# Altium schematic sheet Hub.SchDoc
size B
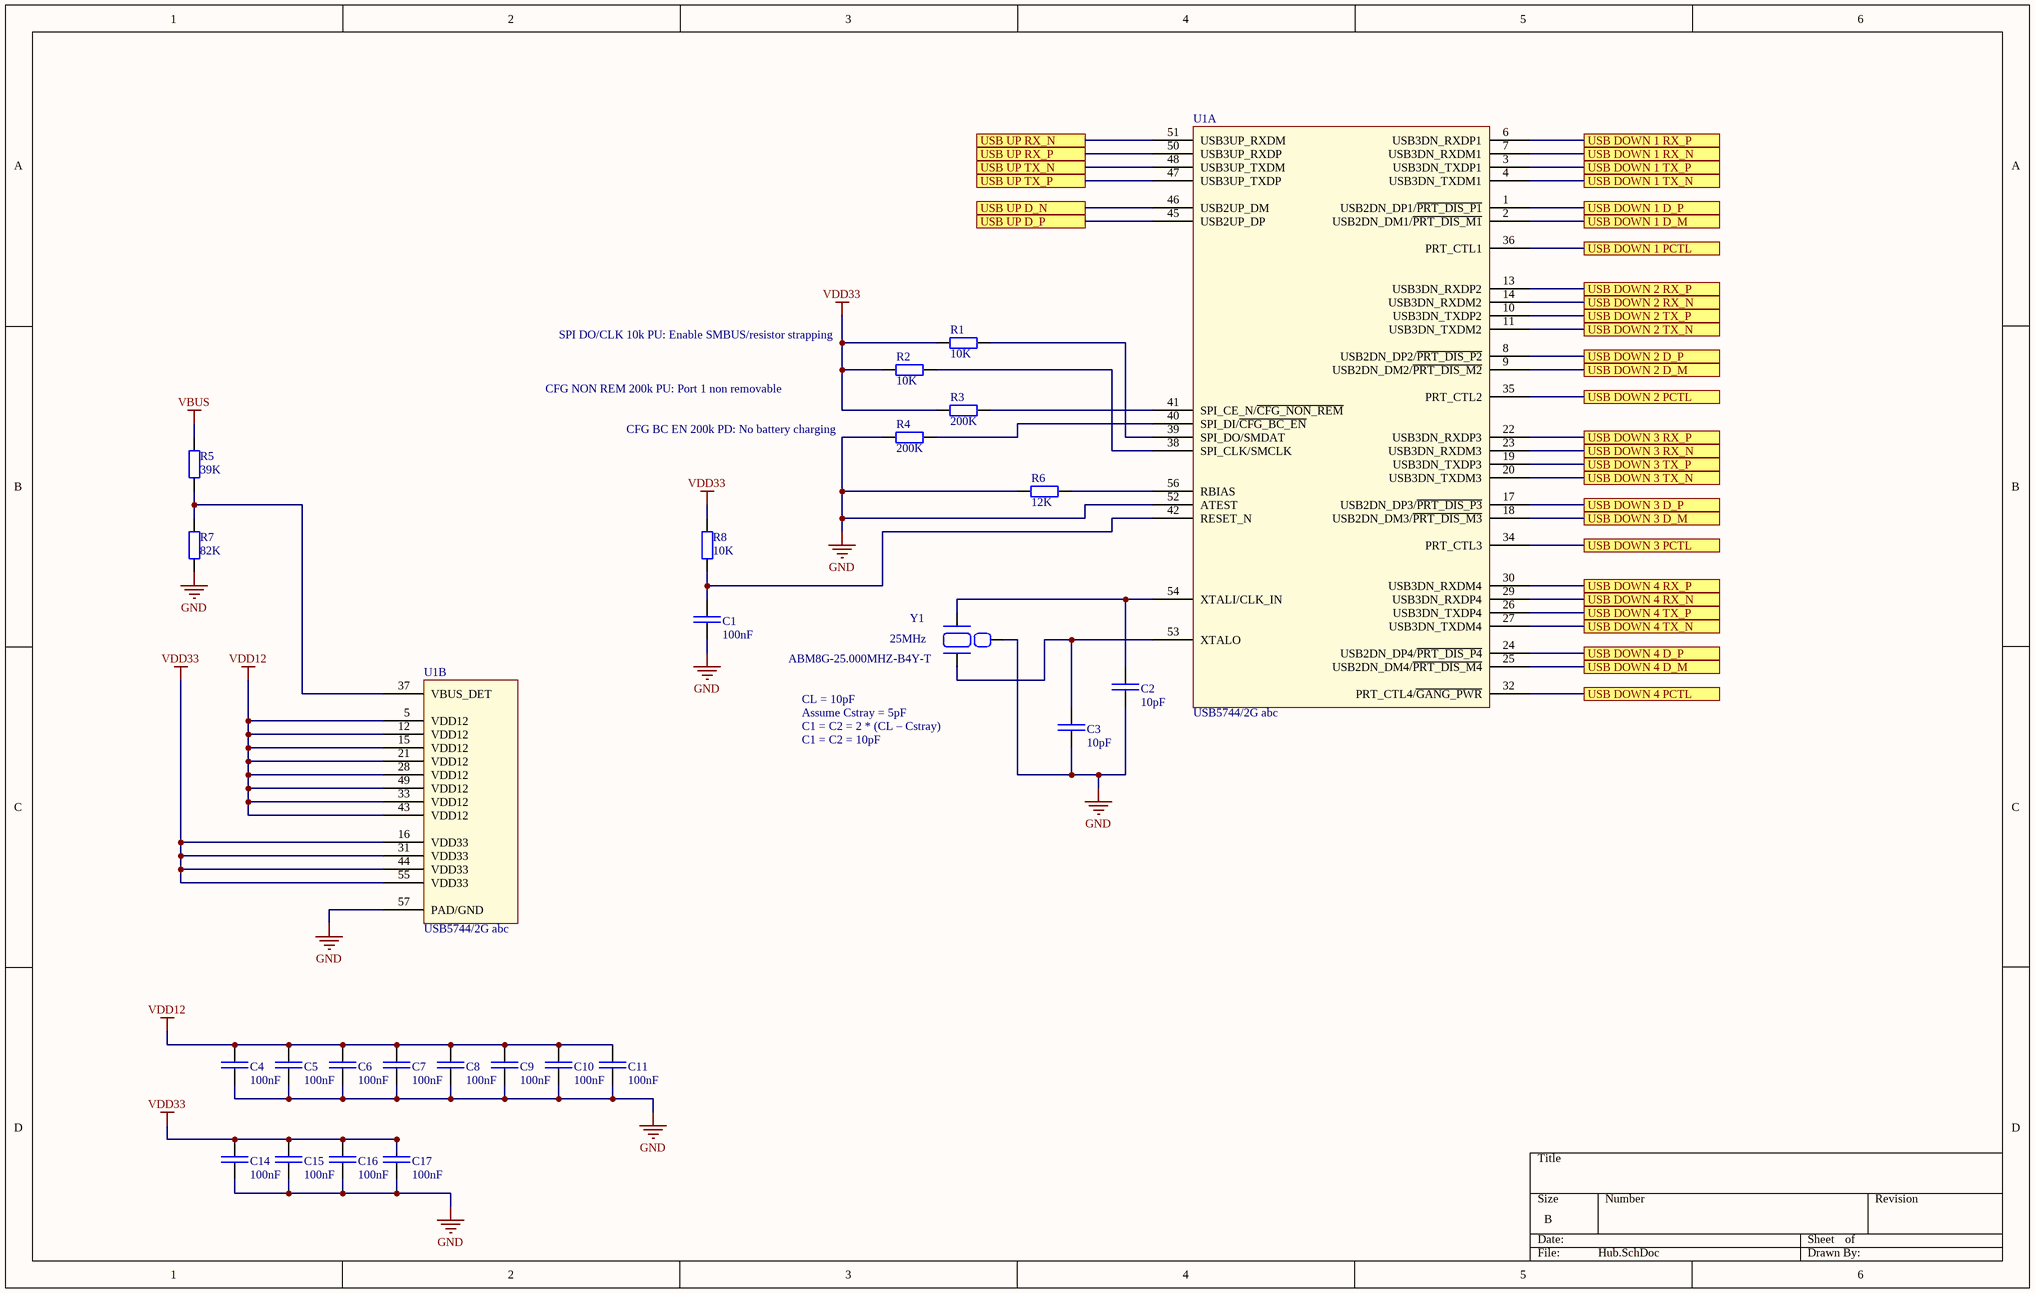
[diagram p0: Hub.SchDoc]

## Parts
C1  100nF  [CAP_SM0603_YAGEOCC2_N]
C2  10pF  [CAP_SM0603_YAGEOCC2_N]
C3  10pF  [CAP_SM0603_YAGEOCC2_N]
C4  100nF  [CAP_SM0603_YAGEOCC2_N]
C5  100nF  [CAP_SM0603_YAGEOCC2_N]
C6  100nF  [CAP_SM0603_YAGEOCC2_N]
C7  100nF  [CAP_SM0603_YAGEOCC2_N]
C8  100nF  [CAP_SM0603_YAGEOCC2_N]
C9  100nF  [CAP_SM0603_YAGEOCC2_N]
C10  100nF  [CAP_SM0603_YAGEOCC2_N]
C11  100nF  [CAP_SM0603_YAGEOCC2_N]
C14  100nF  [CAP_SM0603_YAGEOCC2_N]
C15  100nF  [CAP_SM0603_YAGEOCC2_N]
C16  100nF  [CAP_SM0603_YAGEOCC2_N]
C17  100nF  [CAP_SM0603_YAGEOCC2_N]
R1  10K  [RES_SM0603_YAGEORC_N]
R2  10K  [RES_SM0603_YAGEORC_N]
R3  200K  [RES_SM0603_YAGEORC_N]
R4  200K  [RES_SM0603_YAGEORC_N]
R5  39K  [RES_SM0603_YAGEORC_N]
R6  12K  [RES_SM0603_YAGEORC_N]
R7  82K  [RES_SM0603_YAGEORC_N]
R8  10K  [RES_SM0603_YAGEORC_N]
U1  USB5744/2G abc  [QFN40P700X700X100_HS-57N - USB5744/2G]  (parts A,B of 2)
Y1  ABM8G-25.000MHZ-B4Y-T  [ABM8G-25.000MHZ-B4Y-T]

## Ports
USB DOWN 1 D_M, USB DOWN 1 D_P, USB DOWN 1 PCTL, USB DOWN 1 RX_N, USB DOWN 1 RX_P, USB DOWN 1 TX_N, USB DOWN 1 TX_P, USB DOWN 2 D_M, USB DOWN 2 D_P, USB DOWN 2 PCTL, USB DOWN 2 RX_N, USB DOWN 2 RX_P, USB DOWN 2 TX_N, USB DOWN 2 TX_P, USB DOWN 3 D_M, USB DOWN 3 D_P, USB DOWN 3 PCTL, USB DOWN 3 RX_N, USB DOWN 3 RX_P, USB DOWN 3 TX_N, USB DOWN 3 TX_P, USB DOWN 4 D_M, USB DOWN 4 D_P, USB DOWN 4 PCTL, USB DOWN 4 RX_N, USB DOWN 4 RX_P, USB DOWN 4 TX_N, USB DOWN 4 TX_P, USB UP D_N, USB UP D_P, USB UP RX_N, USB UP RX_P, USB UP TX_N, USB UP TX_P

## Nets
GND: C1.2 C2.1 C3.1 C4.2 C5.2 C6.2 C7.2 C8.2 C9.2 C10.2 C11.2 C14.2 C15.2 C16.2 C17.2 R4.1 R6.1 R7.1 U1.52(ATEST) U1.57(PAD/GND) Y1.GND
VBUS: R5.2
VDD12: C4.1 C5.1 C6.1 C7.1 C8.1 C9.1 C10.1 C11.1 U1.5(VDD12) U1.12(VDD12) U1.15(VDD12) U1.21(VDD12) U1.28(VDD12) U1.33(VDD12) U1.43(VDD12) U1.49(VDD12)
VDD33: C14.1 C15.1 C16.1 C17.1 R1.1 R2.1 R3.1 R8.2 U1.16(VDD33) U1.31(VDD33) U1.44(VDD33) U1.55(VDD33)
USB DOWN 1 D_M: U1.2(USB2DN_DM1/~{PRT_DIS_M1}) ; port USB DOWN 1 D_M
USB DOWN 1 D_P: U1.1(USB2DN_DP1/~{PRT_DIS_P1}) ; port USB DOWN 1 D_P
USB DOWN 1 PCTL: U1.36(PRT_CTL1) ; port USB DOWN 1 PCTL
USB DOWN 1 RX_N: U1.7(USB3DN_RXDM1) ; port USB DOWN 1 RX_N
USB DOWN 1 RX_P: U1.6(USB3DN_RXDP1) ; port USB DOWN 1 RX_P
USB DOWN 1 TX_N: U1.4(USB3DN_TXDM1) ; port USB DOWN 1 TX_N
USB DOWN 1 TX_P: U1.3(USB3DN_TXDP1) ; port USB DOWN 1 TX_P
USB DOWN 2 D_M: U1.9(USB2DN_DM2/~{PRT_DIS_M2}) ; port USB DOWN 2 D_M
USB DOWN 2 D_P: U1.8(USB2DN_DP2/~{PRT_DIS_P2}) ; port USB DOWN 2 D_P
USB DOWN 2 PCTL: U1.35(PRT_CTL2) ; port USB DOWN 2 PCTL
USB DOWN 2 RX_N: U1.14(USB3DN_RXDM2) ; port USB DOWN 2 RX_N
USB DOWN 2 RX_P: U1.13(USB3DN_RXDP2) ; port USB DOWN 2 RX_P
USB DOWN 2 TX_N: U1.11(USB3DN_TXDM2) ; port USB DOWN 2 TX_N
USB DOWN 2 TX_P: U1.10(USB3DN_TXDP2) ; port USB DOWN 2 TX_P
USB DOWN 3 D_M: U1.18(USB2DN_DM3/~{PRT_DIS_M3}) ; port USB DOWN 3 D_M
USB DOWN 3 D_P: U1.17(USB2DN_DP3/~{PRT_DIS_P3}) ; port USB DOWN 3 D_P
USB DOWN 3 PCTL: U1.34(PRT_CTL3) ; port USB DOWN 3 PCTL
USB DOWN 3 RX_N: U1.23(USB3DN_RXDM3) ; port USB DOWN 3 RX_N
USB DOWN 3 RX_P: U1.22(USB3DN_RXDP3) ; port USB DOWN 3 RX_P
USB DOWN 3 TX_N: U1.20(USB3DN_TXDM3) ; port USB DOWN 3 TX_N
USB DOWN 3 TX_P: U1.19(USB3DN_TXDP3) ; port USB DOWN 3 TX_P
USB DOWN 4 D_M: U1.25(USB2DN_DM4/~{PRT_DIS_M4}) ; port USB DOWN 4 D_M
USB DOWN 4 D_P: U1.24(USB2DN_DP4/~{PRT_DIS_P4}) ; port USB DOWN 4 D_P
USB DOWN 4 PCTL: U1.32(PRT_CTL4/~{GANG_PWR}) ; port USB DOWN 4 PCTL
USB DOWN 4 RX_N: U1.29(USB3DN_RXDP4) ; port USB DOWN 4 RX_N
USB DOWN 4 RX_P: U1.30(USB3DN_RXDM4) ; port USB DOWN 4 RX_P
USB DOWN 4 TX_N: U1.27(USB3DN_TXDM4) ; port USB DOWN 4 TX_N
USB DOWN 4 TX_P: U1.26(USB3DN_TXDP4) ; port USB DOWN 4 TX_P
USB UP D_N: U1.46(USB2UP_DM) ; port USB UP D_N
USB UP D_P: U1.45(USB2UP_DP) ; port USB UP D_P
USB UP RX_N: U1.51(USB3UP_RXDM) ; port USB UP RX_N
USB UP RX_P: U1.50(USB3UP_RXDP) ; port USB UP RX_P
USB UP TX_N: U1.48(USB3UP_TXDM) ; port USB UP TX_N
USB UP TX_P: U1.47(USB3UP_TXDP) ; port USB UP TX_P
NetC1_1: C1.1 R8.1 U1.42(RESET_N)
NetC2_2: C2.2 U1.54(XTALI/CLK_IN) Y1.1
NetC3_2: C3.2 U1.53(XTALO) Y1.3
NetR1_2: R1.2 U1.39(SPI_DO/SMDAT)
NetR2_2: R2.2 U1.38(SPI_CLK/SMCLK)
NetR3_2: R3.2 U1.41(SPI_CE_N/~{CFG_NON_REM})
NetR4_2: R4.2 U1.40(SPI_DI/~{CFG_BC_EN})
NetR5_1: R5.1 R7.2 U1.37(VBUS_DET)
NetR6_2: R6.2 U1.56(RBIAS)

## Notes on the sheet
- (near R2) SPI DO/CLK 10k PU: Enable SMBUS/resistor strapping
- CFG NON REM 200k PU: Port 1 non removable
- (near R4) CFG BC EN 200k PD: No battery charging
- CL = 10pF
- C1 = C2 = 2 * (CL – Cstray)
- Assume Cstray = 5pF
- C1 = C2 = 10pF
- (in symbol ABM8G-25.000MHZ-B4Y-T) 25MHz

## Library data of the parts
C1 C4-C11 C14-C17 = CC0603KRX7R9BB104: CAP 100nF SM0603 X7R 50V YAGEO CC2; Tolerance (%): 10; Voltage Rating (Volts): 50; Category: Capacitor; Manufacturer: Yageo; Manufacturer Part Number: CC0603KRX7R9BB104; Package: 0603; Value: 100nF; Supplier Part Number 1: 1362556; Supplier 1: Farnell; ComponentLink1URL: http://www.yageo.com; ComponentLink1Description: Manufacturer Website; Supplier 2: Digi-Key; Supplier Part Number 2: 311-1344-1-ND
C2 C3 = CC0603JRNPO9BN100: CAP 10pF SM0603 NPO 50V YAGEO CC2; Tolerance (%): 5; Voltage Rating (Volts): 50; Category: Capacitor; Manufacturer: Yageo; Manufacturer Part Number: CC0603JRNPO9BN100; Package: 0603; Value: 10pF; Supplier Part Number 1: 721967; Supplier 1: Farnell; ComponentLink1URL: http://www.yageo.com; ComponentLink1Description: Manufacturer Website; Supplier 2: Digi-Key; Supplier Part Number 2: 311-1058-1-ND
R1 R2 R8 = RC0603FR-0710KL: RES 10K SM0603 YAGEO RC_L; Power (Watts): 0.1; Resistance (Ohms): 10000; Tolerance (%): 1; Category: Resistor; Manufacturer: Yageo; Manufacturer Part Number: RC0603FR-0710KL; Package: 0603; Value: 10K; Supplier Part Number 1: 9238603; Supplier 1: Farnell; ComponentLink1URL: http://www.yageo.com; ComponentLink1Description: Manufacturer Website; Supplier 2: Digi-Key; Supplier Part Number 2: 311-10.0KHRCT-ND
R3 R4 = RC0603FR-07200KL: RES 200K SM0603 YAGEO RC_L; Power (Watts): 0.1; Resistance (Ohms): 200000; Tolerance (%): 1; Category: Resistor; Manufacturer: Yageo; Manufacturer Part Number: RC0603FR-07200KL; Package: 0603; Value: 200K; ComponentLink1URL: http://www.yageo.com; ComponentLink1Description: Manufacturer Website; Supplier 2: Digi-Key; Supplier Part Number 2: 311-200KHRCT-ND
R5 = RC0603FR-0739KL: RES 39K SM0603 YAGEO RC_L; Power (Watts): 0.1; Resistance (Ohms): 39000; Tolerance (%): 1; Category: Resistor; Manufacturer: Yageo; Manufacturer Part Number: RC0603FR-0739KL; Package: 0603; Value: 39K; Supplier Part Number 1: 9238670; Supplier 1: Farnell; ComponentLink1URL: http://www.yageo.com; ComponentLink1Description: Manufacturer Website; Supplier 2: Digi-Key; Supplier Part Number 2: 311-39.0KHRCT-ND
R6 = RC0603FR-0712KL: RES 12K SM0603 YAGEO RC_L; Power (Watts): 0.1; Resistance (Ohms): 12000; Tolerance (%): 1; Category: Resistor; Manufacturer: Yageo; Manufacturer Part Number: RC0603FR-0712KL; Package: 0603; Value: 12K; Supplier Part Number 1: 9238611; Supplier 1: Farnell; ComponentLink1URL: http://www.yageo.com; ComponentLink1Description: Manufacturer Website; Supplier 2: Digi-Key; Supplier Part Number 2: 311-12.0KHRCT-ND
R7 = RC0603FR-0782KL: RES 82K SM0603 YAGEO RC_L; Power (Watts): 0.1; Resistance (Ohms): 82000; Tolerance (%): 1; Category: Resistor; Manufacturer: Yageo; Manufacturer Part Number: RC0603FR-0782KL; Package: 0603; Value: 82K; Supplier Part Number 1: 9238719; Supplier 1: Farnell; ComponentLink1URL: http://www.yageo.com; ComponentLink1Description: Manufacturer Website; Supplier 2: Digi-Key; Supplier Part Number 2: 311-82.0KHRCT-ND
U1 = USB5744/2G abc: IC HUB CTLR USB 56VQFN
Y1 = ABM8G-25.000MHZ-B4Y-T: CRYSTAL 25.0000MHZ 10PF SMD